# EAGLE schematic Power Board (EAGLE 6.3)
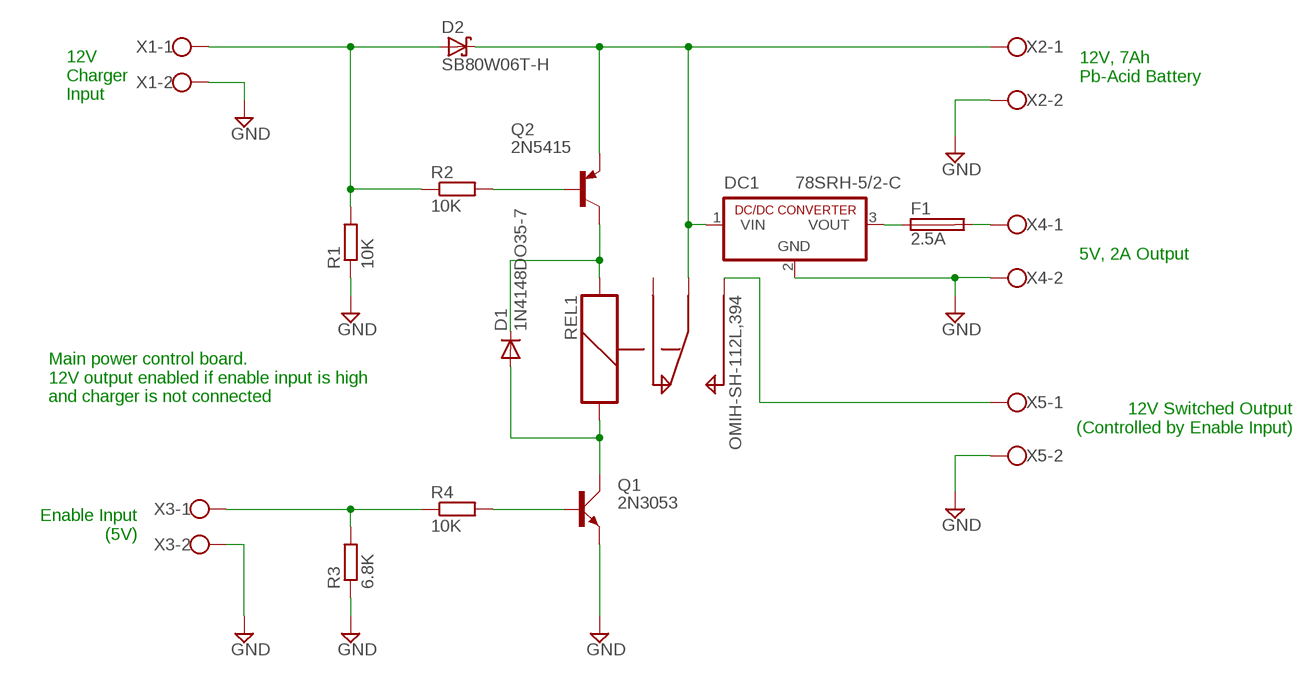
[diagram p0: schematic, sheet 1]

## Parts
D1  1N4148DO35-7  [DO35-7]
D2  SB80W06T-H  BAT54  [SOT23]
DC1  78SRH-5/2-C  R-78C5.0-1.0  [SIP3]
F1  2.5A  19560  [19560]
Q1  2N3053  [TO39]
Q2  2N5415  [TO39]
R1  10K  R-EU_0204/5  [0204/5]
R2  10K  R-EU_0204/5  [0204/5]
R3  6.8K  R-EU_0204/5  [0204/5]
R4  10K  R-EU_0204/5  [0204/5]
REL1  OMIH-SH-112L,394  REL-5PIN  [REL-5PIN]
X1  W237-102  [W237-102]
X2  W237-102  [W237-102]
X3  W237-102  [W237-102]
X4  W237-102  [W237-102]
X5  W237-102  [W237-102]

## Nets
GND: DC1.2(GND) Q1.1(E) R1.1 R3.1 X1.2 X2.2 X3.2 X4.2 X5.2
N$1: D2.1(A) R1.2 R2.1 X1.1
N$2: D2.3(C) DC1.1(VIN) Q2.1(E) REL1.C X2.1
N$3: DC1.3(VOUT) F1.1
N$4: R3.2 R4.1 X3.1
N$5: F1.2 X4.1
N$6: D1.A Q1.3(C) REL1.S2
N$7: Q1.2(B) R4.2
N$8: D1.C Q2.3(C) REL1.S1
N$9: Q2.2(B) R2.2
N$10: REL1.O X5.1
Unconnected: REL1.S

## Notes on the sheet
- 12V, 7Ah
  Pb-Acid Battery
- 12V 
  Charger 
  Input
- 5V, 2A Output
- Main power control board. 
  12V output enabled if enable input is high
  and charger is not connected
- 12V Switched Output
  (Controlled by Enable Input)
- Enable Input
  (5V)

## Library data of the parts
D1 = diode:1N4148: DIODE high speed (Philips)
D2 = diode:BAT54: Schottky Diodes Source: Fairchild .. BAT54.pdf
DC1 = dc-dc-converter:R-78C*-1.0: INNOLINE DC/DC-Converter 1.0 AMP SIP3 Single Output Source: Data sheet <http://www.mikrocontroller.net/attachment/150645/157764-da-01-en-DC_DC_WANDLER_R_78C5_0_1_0.pdf>
F1 = fuse:19560: FUSE HOLDER TR5, Wickmann; MPN: 56000001009; OC_FARNELL: 1185363; OC_NEWARK: 15P8392
Q1 = transistor-small-signal:2N3053: NPN TRANSISTOR
Q2 = transistor-pnp:2N5415*: PNP Transistror
R1-R4 = resistor:R-EU_: RESISTOR, European symbol
REL1 = special:REL-5PIN: RELAY
X1-X5 = con-wago-500:W237-102: WAGO SCREW CLAMP; MPN: 237-102; OC_FARNELL: unknown; OC_NEWARK: 70K9898